# EAGLE schematic usb-lcd-2line (EAGLE 5.11)
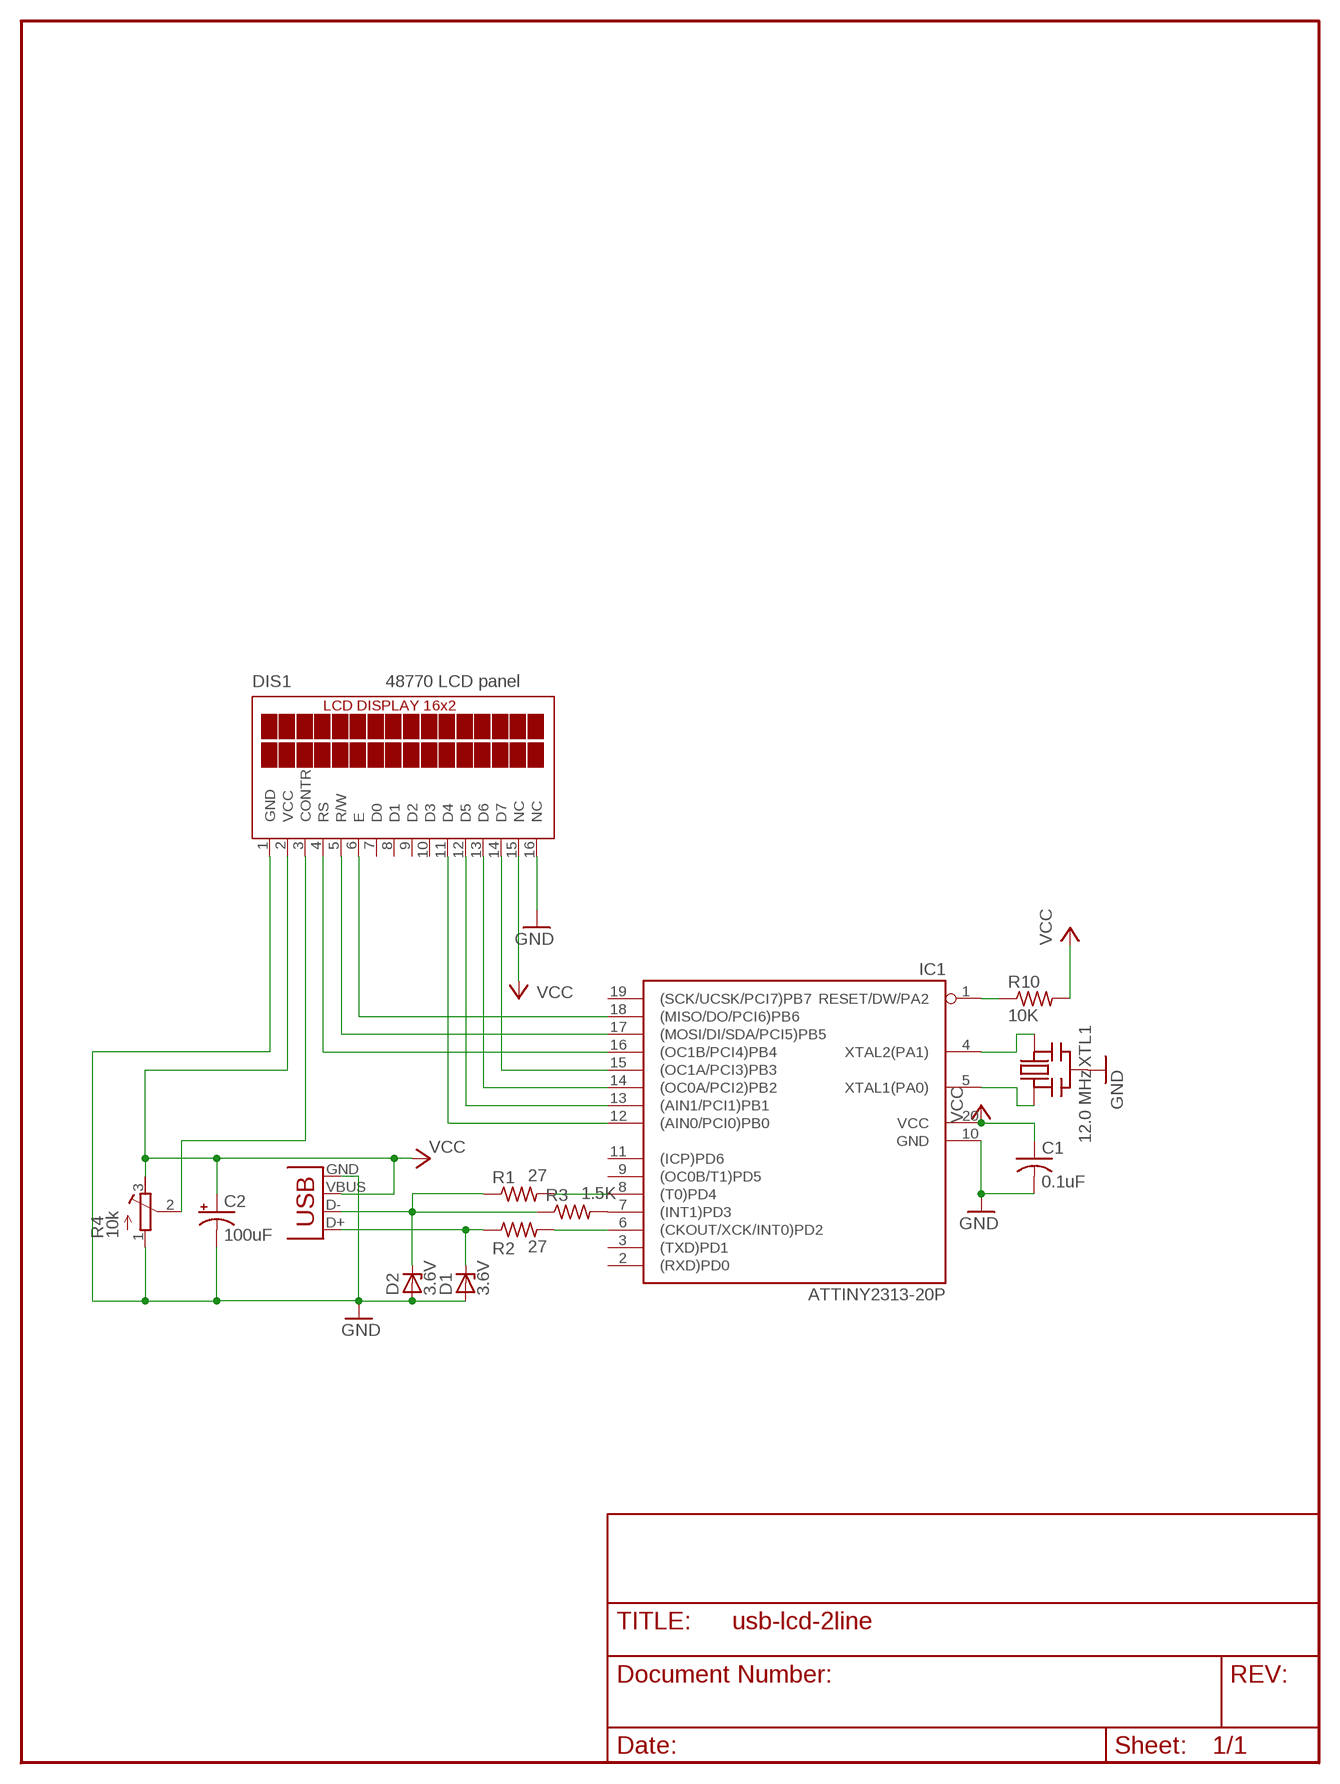
[diagram p0: schematic, sheet 1]

## Parts
C1  0.1uF  C-US025-025X050  [C025-025X050]
C2  100uF  CPOL-USE2.5-5  [E2,5-5]
D1  3.6V  ZENER-DIODEDO35Z10  [DO35Z10]
D2  3.6V  ZENER-DIODEDO35Z10  [DO35Z10]
DIS1  48770 LCD panel  TUXGR_16X2_R2  [TUXGR_16X2_R2]
IC1  ATTINY2313-20P  [DIL20]
R1  27  R-US_0207/10  [0207/10]
R2  27  R-US_0207/10  [0207/10]
R3  1.5K  R-US_0207/10  [0207/10]
R4  10k  R-TRIMM3296W  [RTRIM3296W]
R10  10K  R-US_0207/10  [0207/10]
X2  USBSMD  [USB-MINIB]
XTL1  12.0 MHz  CERMOSCILL  [CERM_OSC]

## Nets
GND: C1.2 C2.- D1.A D2.A DIS1.1(GND) DIS1.16(NC) IC1.10(GND) R4.1(E) X2.GND XTL1.P$2(GND)
N$1: D2.C R1.1 R3.1 X2.D-
N$2: IC1.5(XTAL1(PA0)) XTL1.P$1(IN)
N$3: IC1.8((T0)PD4) R1.2
N$4: IC1.4(XTAL2(PA1)) XTL1.P$3(OUT)
N$5: IC1.7((INT1)PD3) R3.2
N$6: IC1.6((CKOUT/XCK/INT0)PD2) R2.2
N$9: IC1.1(RESET/DW/PA2) R10.1
N$10: D1.C R2.1 X2.D+
N$11: DIS1.3(CONTR) R4.2(S)
N$13: DIS1.4(RS) IC1.16((OC1B/PCI4)PB4)
N$14: DIS1.14(D7) IC1.15((OC1A/PCI3)PB3)
N$15: DIS1.13(D6) IC1.14((OC0A/PCI2)PB2)
N$16: DIS1.12(D5) IC1.13((AIN1/PCI1)PB1)
N$17: DIS1.11(D4) IC1.12((AIN0/PCI0)PB0)
N$18: DIS1.6(E) IC1.18((MISO/DO/PCI6)PB6)
N$19: DIS1.5(R/W) IC1.17((MOSI/DI/SDA/PCI5)PB5)
VCC: C1.1 C2.+ DIS1.2(VCC) DIS1.15(NC) IC1.20(VCC) R4.3(A) R10.2 X2.VBUS
Unconnected: DIS1.7(D0) DIS1.8(D1) DIS1.9(D2) DIS1.10(D3) IC1.2((RXD)PD0) IC1.3((TXD)PD1) IC1.9((OC0B/T1)PD5) IC1.11((ICP)PD6) IC1.19((SCK/UCSK/PCI7)PB7)

## Library data of the parts
C1 = rcl-ez:C-US: CAPACITOR, American symbol
C2 = rcl-ez:CPOL-US: POLARIZED CAPACITOR, American symbol
D1 D2 = diode:ZENER-DIODE: Z-Diode
DIS1 = display-lcd:TUXGR_16X2_R2: Tuxgraphics LCD display 16x2 characters reflective, without background light Source: tuxgr_12x2_r2.pdf; OC_FARNELL: unknown; OC_NEWARK: unknown
IC1 = avr:ATTINY2313: MICROCONTROLLER 2 Kbytes FLASH 128 bytes SRAM 128 bytes EEPROM USART USI
R1-R3 R10 = rcl-ez:R-US_: RESISTOR, American symbol
R4 = resistor:R-TRIMM: Trimm resistor
X2 = SparkFun:USB: USB Connectors USB-B-PTH is fully proven SKU : PRT-00139 USB-miniB is fully proven SKU : PRT-00587 USB-A-PCB is untested. USB-A-H is throughly reviewed, but untested. Spark Fun Electronics SKU : PRT-00437 USB-B-SMT is throughly reviewed, but untested. Needs silkscreen touching up. USB-A-S has not been used/tested USB-MB-H has not been used/tested
XTL1 = minimidi:CERMOSCILL